# EAGLE design cdf-interrupter (EAGLE 7.5.0)
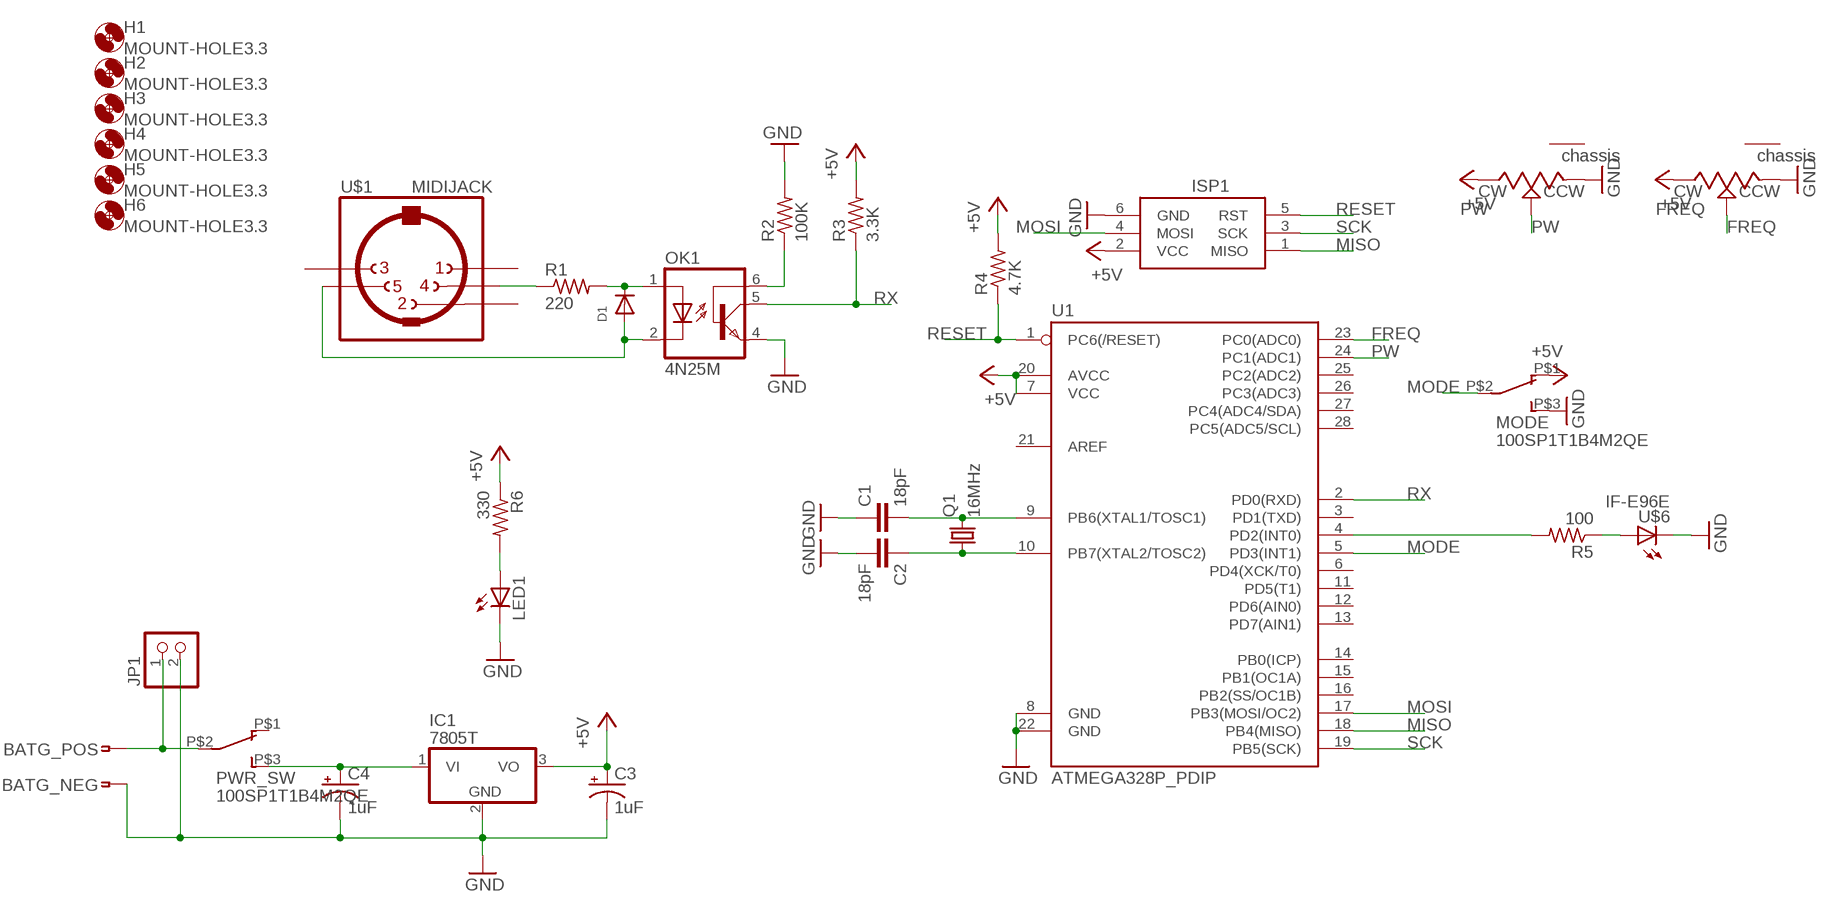
[diagram p0: schematic, sheet 1]

## Parts
BAT  KEYSTONE-9V-BAT-HOLDER-1291  [KEYSTONE-9V-BAT-HOLDER-1291]
C1  18pF  C-EU050-025X075  [C050-025X075]
C2  18pF  C-EU050-025X075  [C050-025X075]
C3  1uF  CPOL-USE2-4  [E2-4]
C4  1uF  CPOL-USE2-4  [E2-4]
D1  DIODEDO-1N4148  [DO-1N4148]
FREQ  POTENTIOMETERPTV09A_VERTICAL  [PTV09A-4]
H1  MOUNT-HOLE3.3  [3,3]
H2  MOUNT-HOLE3.3  [3,3]
H3  MOUNT-HOLE3.3  [3,3]
H4  MOUNT-HOLE3.3  [3,3]
H5  MOUNT-HOLE3.3  [3,3]
H6  MOUNT-HOLE3.3  [3,3]
IC1  7805T  [TO220H]
ISP1  AVRISP-BOX  [AVRISP-BOX]
JP1  PINHD-1X2  [1X02]
LED1  LED5MM  [LED5MM]
MODE  100SP1T1B4M2QE  [100SP1T1B4M2QE]
OK1  4N25M  [DIL06]
PW  POTENTIOMETERPTV09A_VERTICAL  [PTV09A-4]
PWR_SW  100SP1T1B4M2QE  [100SP1T1B4M2QE]
Q1  16MHz  CRYSTALHC49UP  [HC49UP]
R1  220  R-US_0204/7  [0204/7]
R2  100K  R-US_0204/7  [0204/7]
R3  3.3K  R-US_0204/7  [0204/7]
R4  4.7K  R-US_0204/7  [0204/7]
R5  100  R-US_0204/7  [0204/7]
R6  330  R-US_0204/7  [0204/7]
U1  ATMEGA328P_PDIP  [DIL28-3]
U$1  MIDIJACK  [CP-2350]
U$6  IF-E96E  [IF-E96E]

## Nets
+5V: C3.+ FREQ.3(CW) IC1.3(VO) ISP1.2(VCC) MODE.P$1 PW.3(CW) R3.2 R4.2 R6.1 U1.7(VCC) U1.20(AVCC)
FREQ: FREQ.2(WIPER) U1.23(PC0(ADC0))
GND: BAT.P_NEG C1.1 C2.2 C3.- C4.- FREQ.1(CCW) IC1.2(GND) ISP1.6(GND) JP1.2 LED1.K(C) MODE.P$3 OK1.4(EMI) PW.1(CCW) R2.2 U1.8(GND) U1.22(GND) U$6.P$1_CATHODE-(C)
MISO: ISP1.1(MISO) U1.18(PB4(MISO))
MODE: MODE.P$2 U1.5(PD3(INT1))
MOSI: ISP1.4(MOSI) U1.17(PB3(MOSI/OC2))
N$1: R1.1 U$1.4
N$2: D1.C OK1.1(A) R1.2
N$3: D1.A OK1.2(C) U$1.5
N$4: OK1.6(BAS) R2.1
N$5: C1.2 Q1.2 U1.9(PB6(XTAL1/TOSC1))
N$6: C2.1 Q1.1 U1.10(PB7(XTAL2/TOSC2))
N$7: R5.2 U1.4(PD2(INT0))
N$8: R5.1 U$6.P$2_ANODE+(A)
N$9: LED1.A R6.2
N$10: BAT.P_POS JP1.1 PWR_SW.P$2
N$11: C4.+ IC1.1(VI) PWR_SW.P$3
PW: PW.2(WIPER) U1.24(PC1(ADC1))
RESET: ISP1.5(RST) R4.1 U1.1(PC6(/RESET))
RX: OK1.5(COL) R3.1 U1.2(PD0(RXD))
SCK: ISP1.3(SCK) U1.19(PB5(SCK))
Unconnected: FREQ.4(CHASSIS) PW.4(CHASSIS) PWR_SW.P$1 U1.3(PD1(TXD)) U1.6(PD4(XCK/T0)) U1.11(PD5(T1)) U1.12(PD6(AIN0)) U1.13(PD7(AIN1)) U1.14(PB0(ICP)) U1.15(PB1(OC1A)) U1.16(PB2(SS/OC1B)) U1.21(AREF) U1.25(PC2(ADC2)) U1.26(PC3(ADC3)) U1.27(PC4(ADC4/SDA)) U1.28(PC5(ADC5/SCL)) U$1.1 U$1.2 U$1.3

## Library data of the parts
BAT = keves:KEYSTONE-9V-BAT-HOLDER-1291
C1 C2 = rcl:C-EU: CAPACITOR, European symbol
C3 C4 = rcl:CPOL-US: POLARIZED CAPACITOR, American symbol
D1 = adafruit:DIODE: Diode SMADIODE - SMA Surface Mount Package 20V 1A Schottky Diode Digikey: 641-1014-6-ND DO-1N4148 - Through Hole Small Current Diode SOD-123 20V 1 A (.5mV Vf) Schottky Diode - Digikey: MBRX120TPMSCT-ND SOD-323 10V 570mA (.38mV Vf, 3ns) Schottky Diode - Digikey: ZLLS410CT-ND SOD-523 30V 30mA Schottky Diode (RB751S-40TE61) - Digikey: RB751S-40TE61CT-ND SOT23-R/W - SOT23 Package (R = Solder Paste/Reflow Ovens, W = Hand-Soldering) BAT54Film 40V 300mA - Digikey: 497-7162-1-ND
FREQ PW = Bourns:POTENTIOMETER
H1-H6 = holes:MOUNT-HOLE: MOUNTING HOLE with drill center marker
IC1 = adafruit:78*: Positive VOLTAGE REGULATOR Added bigger pads to the TO-92 package
ISP1 = adafruit:AVRISP: AVR ISP HEADER Standard 6 pin header for AVR programming
JP1 = pinhead:PINHD-1X2: PIN HEADER
LED1 = adafruit:LED: LED OSRAM: - CHIPLED LG R971, LG N971, LY N971, LG Q971, LY Q971, LO R971, LY R971 LH N974, LH R974 LS Q976, LO Q976, LY Q976 LO Q996 - Hyper CHIPLED LW Q18S LB Q993, LB Q99A, LB R99A - SideLED LS A670, LO A670, LY A670, LG A670, LP A670 LB A673, LV A673, LT A673, LW A673 LH A674 LY A675 LS A676, LA A676, LO A676, LY A676, LW A676 LS A679, LY A679, LG A679 - Hyper Micro SIDELED® LS Y876, LA Y876, LO Y876, LY Y876 LT Y87S - SmartLED LW L88C, LW L88S LB L89C, LB L89S, LG L890 LS L89K, LO L89K, LY L89K LS L896, LA L896, LO L896, LY L896 - TOPLED LS T670, LO T670, LY T670, LG T670, LP T670 LSG T670, LSP T670, LSY T670, LOP T670, LYG T670 LG T671, LOG T671, LSG T671 LB T673, LV T673, LT T673, LW T673 LH T674 LS T676, LA T676, LO T676, LY T676, LB T676, LH T676, LSB T676, LW T676 LB T67C, LV T67C, LT T67C, LS T67K, LO T67K, LY T67K, LW E67C LS E67B, LA E67B, LO E67B, LY E67B, LB E67C, LV E67C, LT E67C LW T67C LS T679, LY T679, LG T679 LS T770, LO T770, LY T770, LG T770, LP T770 LB T773, LV T773, LT T773, LW T773 LH T774 LS E675, LA E675, LY E675, LS T675 LS T776, LA T776, LO T776, LY T776, LB T776 LHGB T686 LT T68C, LB T68C - Hyper Mini TOPLED® LB M676 - Mini TOPLED Santana® LG M470 LS M47K, LO M47K, LY M47K Source: http://www.osram.convergy.de/
MODE PWR_SW = keves:100SP1T1B4M2QE: 100SP1T1B4M2QE SPDT SWITCH
OK1 = optocoupler:4N*?M: General Purpose 6-Pin Phototransistor Optocouplers Source: http://www.fairchildsemi.com/ds/4N/4N35-M.pdf; MPN: 4N25-M; OC_FARNELL: 1021349; OC_NEWARK: 98K9084
Q1 = adafruit:CRYSTAL: CRYSTAL; OC_FARNELL: unknown; OC_NEWARK: unknown
R1-R6 = rcl:R-US_: RESISTOR, American symbol
U1 = SparkFun-DigitalIC:ATMEGA328P_PDIP: uC used in the Arduino 32kb flash, 1k EEPROM, 2k SRAM This is the through-hole version of this chip.
U$1 = keves:MIDIJACK: DIN 5 jack also known as MIDI jack A modification of conn-hirshman:MAB5SH with two options for the grounding 'teeth'
U$6 = keves:IF-E96E

## Board
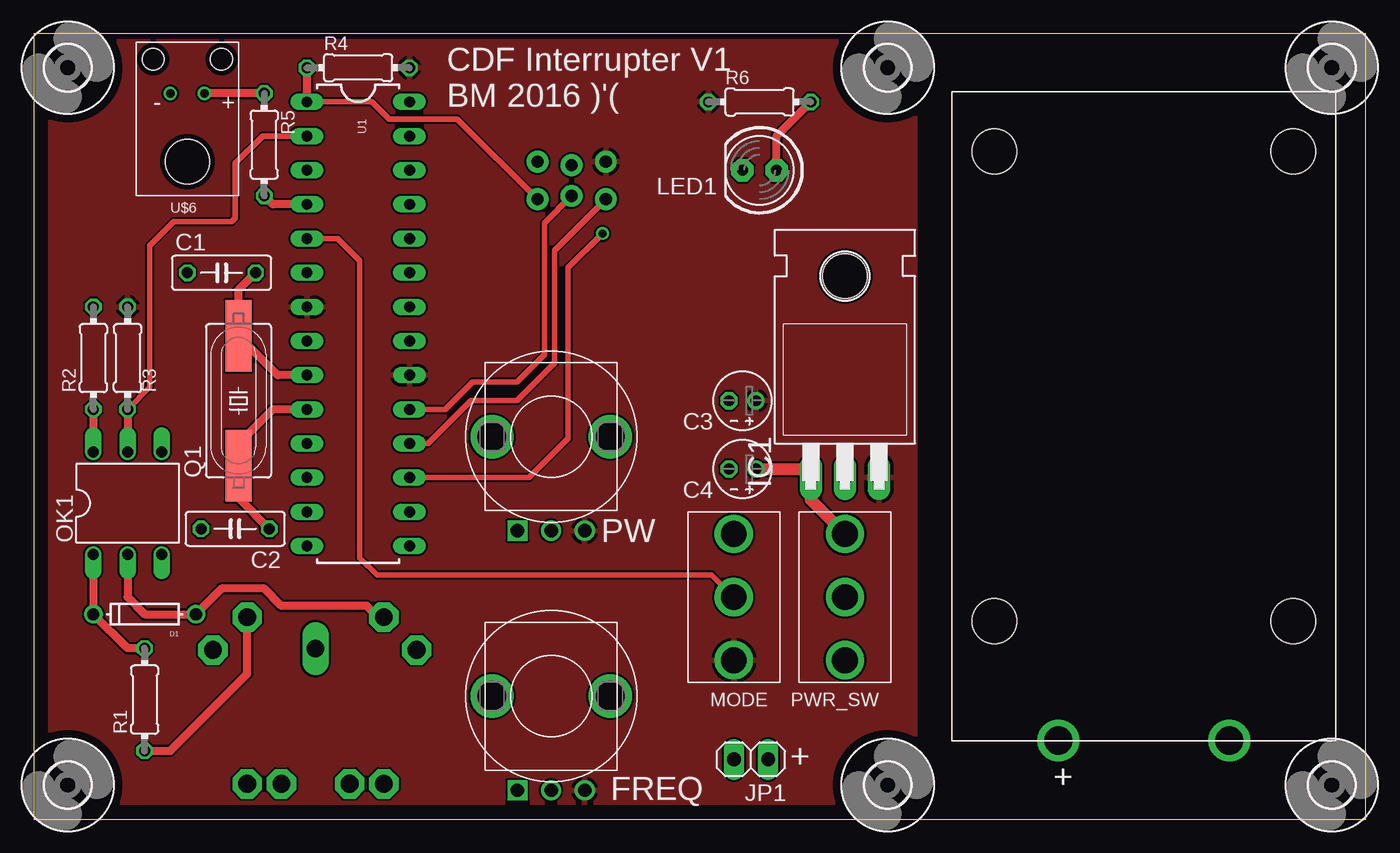
[diagram p1: board, top side]
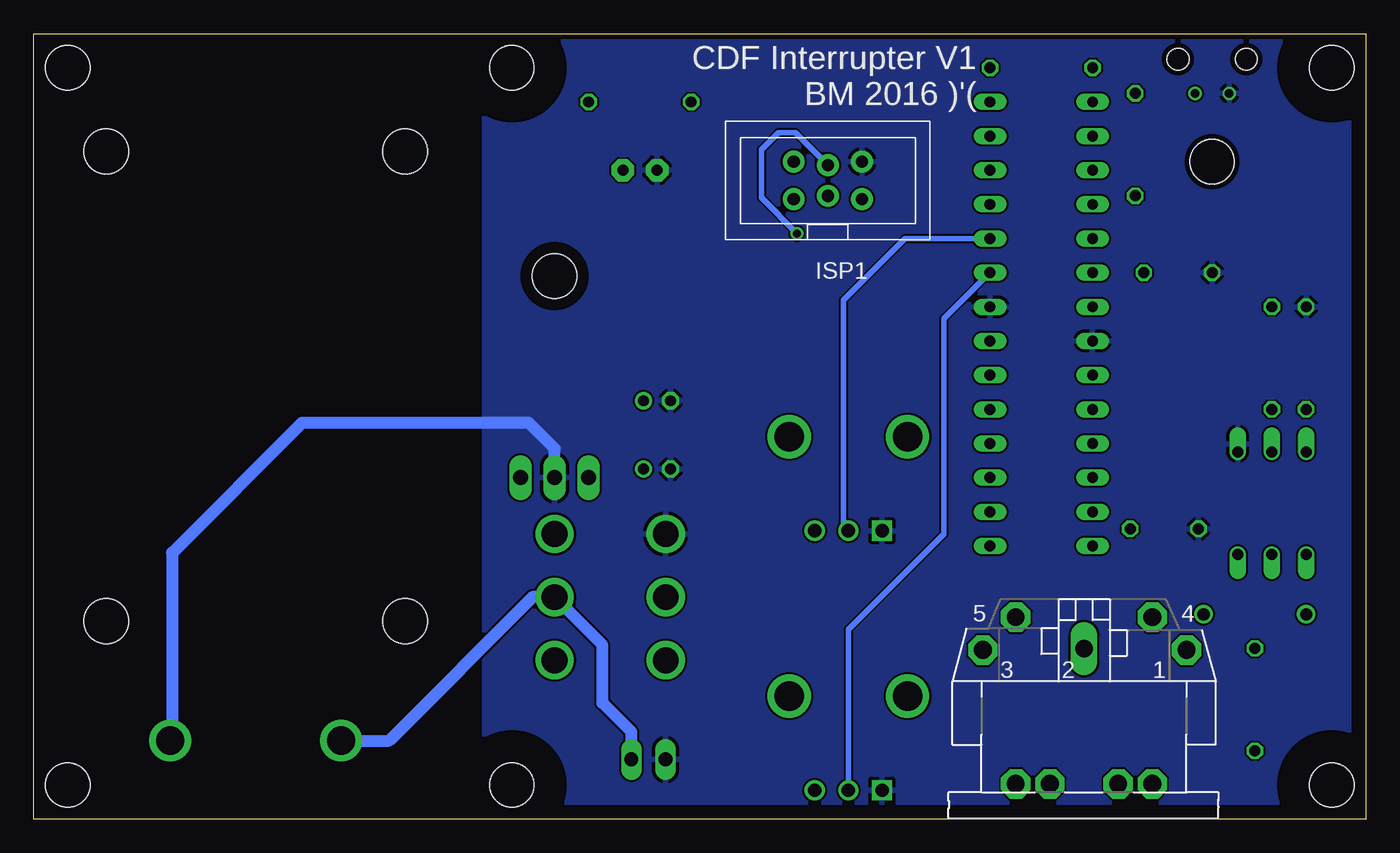
[diagram p2: board, bottom side, seen from below]

Size 99.06 x 58.42 mm. Coordinates in mm from the lower left corner, seen from the top.
Outline: 0,0 99.06,0 99.06,58.42 0,58.42 0,0
Copper layers (1*16): Top 0.0356mm / dielectric 1.5011mm / Bottom 0.0356mm
Design rules "oshpark": minimum track width 6mil, minimum drill 13mil, track to track 6mil, track to pad 6mil, pad to pad 6mil, via to via 6mil, smd to smd 6mil, copper to edge 15mil, drill to drill 6mil, minimum pad ring 7mil, minimum via ring 7mil, stop-mask expansion 3mil, vias tented up to drill 0mil, thermal gap 10mil

### Footprints (pad centres in the part's own frame; a part is rotated, then mirrored left to right if it is on the bottom)
KEYSTONE-9V-BAT-HOLDER-1291 = drill 2.083: P_NEG 0,6.35; P_POS 0,-6.35 | hole 3.353: -8.89,11.113; -43.815,11.113; -43.815,-11.113; -8.89,-11.113
C050-025X075 = drill 0.813 octagon: 1 -2.54,0; 2 2.54,0
E2-4 = drill 0.813 pad 1.27: + -1.016,0 | drill 0.813 pad 1.27 octagon: - 1.016,0
DO-1N4148 = drill 0.9: A -3.81,0; C 3.81,0
PTV09A-4 = drill 1 square: 1 -2.5,-7 | drill 1: 2 0,-7; 3 2.5,-7 | drill 2.2: 4 -4.4,0; 5 4.4,0
3,3 = hole 3.3: 0,0
TO220H = drill 1.118 long: 1 -2.54,-10.16; 2 0,-10.16; 3 2.54,-10.16 | hole 3.302: 0,4.826
AVRISP-BOX = drill 0.9 pad 1.626: 1 -1.397,2.54; 2 1.397,2.54; 3 -1.143,0; 4 1.143,0; 5 -1.397,-2.54; 6 1.397,-2.54
1X02 = drill 1.016 long: 1 -1.27,0; 2 1.27,0
LED5MM = drill 0.813 pad 1.676 octagon: A -1.27,0; K 1.27,0
100SP1T1B4M2QE = drill 1.905: P$1 -4.699,0; P$2 0,0; P$3 4.699,0
DIL06 = drill 0.813 offset: 1 -2.54,-3.81; 2 0,-3.81; 3 2.54,-3.81; 4 2.54,3.81; 5 0,3.81; 6 -2.54,3.81
HC49UP = smd 5.334 x 1.93: 1 -4.826,0; 2 4.826,0
0204/7 = drill 0.813 octagon: 1 -3.81,0; 2 3.81,0
DIL28-3 = drill 0.813 long: 1 -16.51,-3.81; 2 -13.97,-3.81; 3 -11.43,-3.81; 4 -8.89,-3.81; 5 -6.35,-3.81; 6 -3.81,-3.81; 7 -1.27,-3.81; 8 1.27,-3.81; 9 3.81,-3.81; 10 6.35,-3.81; 11 8.89,-3.81; 12 11.43,-3.81; 13 13.97,-3.81; 14 16.51,-3.81; 15 16.51,3.81; 16 13.97,3.81; 17 11.43,3.81; 18 8.89,3.81; 19 6.35,3.81; 20 3.81,3.81; 21 1.27,3.81; 22 -1.27,3.81; 23 -3.81,3.81; 24 -6.35,3.81; 25 -8.89,3.81; 26 -11.43,3.81; 27 -13.97,3.81; 28 -16.51,3.81
CP-2350 = drill 1.321 pad 2.184 octagon: 1 7.62,12.58; 3 -7.52,12.58; 4 5.08,15.02; 5 -5.08,15.02; PE -2.54,2.62; PE1 -5.08,2.62; PE2 5.08,2.62; PE@ 2.54,2.62 | drill 1.321 long: 2 0,12.68
IF-E96E = drill 0.635: P$1_CATHODE- -1.27,-2.54; P$2_ANODE+ 1.27,-2.54 | hole 3.302: 0,-7.62 | hole 1.626: 2.54,0; -2.54,0

### Placement (x,y rotation side)
BAT  82.55,5.84 270 top
C1  13.97,40.64 0 top
C2  14.99,21.59 180 top
C3  52.7,31.11 180 top
C4  52.7,26.04 180 top
D1  8.26,15.24 180 top
FREQ  38.48,9.14 0 top
H1  2.54,2.54 0 top
H2  2.54,55.88 0 top
H3  63.5,55.88 0 top
H4  63.5,2.54 0 top
H5  96.52,2.54 0 top
H6  96.52,55.88 0 top
IC1  60.33,35.56 0 top
ISP1  40.01,47.5 90 bottom
JP1  53.34,4.45 180 top
LED1  53.98,48.26 180 top
MODE  52.07,16.51 90 top
OK1  6.99,23.5 0 top
PW  38.48,28.45 0 top
PWR_SW  60.33,16.51 90 top
Q1  15.24,31.11 90 top
R1  8.26,8.89 90 top
R2  4.45,34.29 90 top
R3  6.99,34.29 90 top
R4  24.13,55.88 0 top
R5  17.14,50.16 270 top
R6  53.98,53.34 0 top
U1  24.13,36.83 270 top
U$1  20.95,0 0 bottom
U$6  11.43,56.52 0 top

### Tracks (layer width: path | path; a pad name or v marks a point on that pad's centre or on a via)
+5V
  pour Top: 1.27,57.91 65.53,57.91 65.53,1.27 1.27,1.27
FREQ
  Bottom 0.406: U1.23 31.37,37.21 31.37,21.21 38.48,14.1 FREQ.2
GND
  Bottom 0.889: IC1.2 60.33,27.56 62.23,29.46 79.12,29.46 88.77,19.81 88.77,5.97 BAT.P_NEG
  pour Bottom: 1.27,1.27 65.53,1.27 65.53,57.91 1.27,57.91
MISO
  Top 0.406: U1.18 29.34,27.94 32.51,31.11 35.94,31.11 38.73,33.91 38.73,42.29 ISP1.1
MODE
  Top 0.406: U1.5 22.61,43.18 24.26,41.53 24.26,19.43 25.53,18.16 50.42,18.16 MODE.P$2
MOSI  (via drill 0.6)
  Top 0.406: U1.17 36.83,25.4 39.75,28.32 39.75,41.02 v42.29,43.56
  Bottom 0.406: v42.29,43.56 44.96,46.23 44.96,49.78 43.69,51.05 42.42,51.05 ISP1.4
N$1
  Top 0.61: R1.1 10.16,5.08 15.88,10.79 U$1.4
N$2
  Top 0.61: OK1.1 D1.C 6.99,12.7 R1.2
N$3
  Top 0.61: U$1.5 25.62,15.02 24.77,15.88 18.41,15.88 17.14,17.14 13.97,17.14 D1.A 8.26,15.24 6.99,16.51 OK1.2
N$4
  Top 0.61: R2.1 OK1.6
N$5
  Top 0.61: U1.9 18.16,33.02 Q1.2 15.24,39.37 C1.2
N$6
  Top 0.61: U1.10 17.78,30.48 15.24,27.94 Q1.1 15.24,23.88 C2.1
N$7
  Top 0.61: U1.4 17.78,45.72 R5.2
N$8
  Top 0.61: R5.1 U$6.P$2_ANODE+
N$9
  Top 0.61: LED1.A 55.24,50.8 R6.2
N$10
  Bottom 0.889: BAT.P_POS 72.64,5.84 61.98,16.51 PWR_SW.P$2 56.77,12.95 56.77,8.64 54.61,6.48 JP1.1
N$11
  Top 0.889: PWR_SW.P$3 57.78,23.75 IC1.1 57.15,26.04 C4.+
PW
  Bottom 0.406: U1.24 34.29,43.18 38.86,38.61 38.86,21.83 PW.2
RESET
  Top 0.406: U1.1 25.15,53.34 26.42,52.07 31.5,52.07 ISP1.5
  Top 0.61: U1.1 R4.1
RX
  Top 0.406: U1.2 17.02,50.8 14.99,48.77 14.99,44.7 14.73,44.45 10.41,44.45 8.64,42.67 8.64,32.13 R3.1
  Top 0.61: R3.1 OK1.5
SCK
  Top 0.406: U1.19 30.61,30.48 32.64,32.51 35.94,32.51 37.97,34.54 37.97,44.32 ISP1.3

### Text on the board
tPlace: CDF Interrupter V1 / BM 2016 )'( | PW | + | FREQ | +
bPlace: CDF Interrupter V1 / BM 2016 )'(